# EAGLE design knobtesterB (EAGLE 9.6.2)
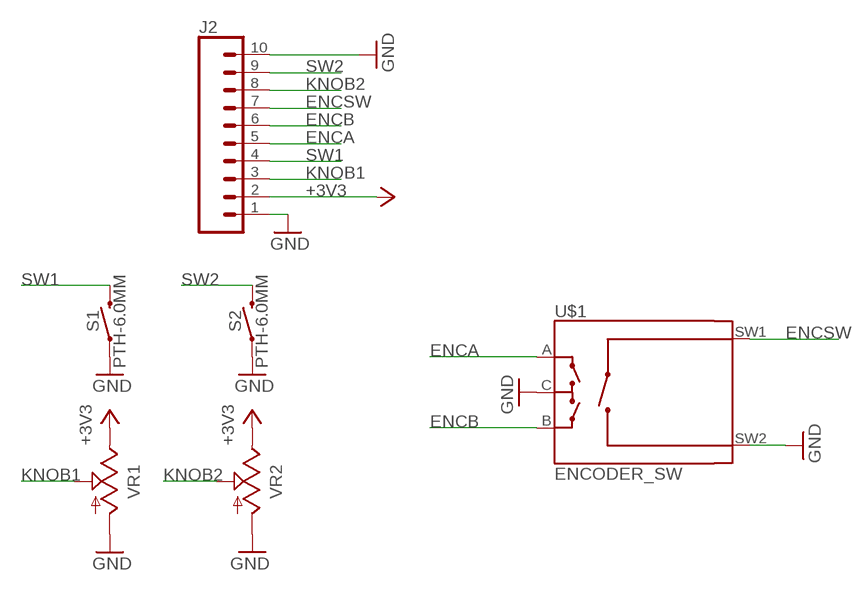
[diagram p0: schematic, sheet 1]

## Parts
J2  CONN_10"  [1X10]
S1  PTH-6.0MM  MOMENTARY-SWITCH-SPST-PTH-6.0MM  [TACTILE_SWITCH_PTH_6.0MM]
S2  PTH-6.0MM  MOMENTARY-SWITCH-SPST-PTH-6.0MM  [TACTILE_SWITCH_PTH_6.0MM]
U$1  ENCODER_SW  [ENCODER_SW]
VR1  9MM_SNAP-IN_POT_  [9MM_SNAP-IN_POT]
VR2  9MM_SNAP-IN_POT_  [9MM_SNAP-IN_POT]

## Nets
+3V3: J2.2 VR1.3(E) VR2.3(E)
ENCA: J2.5 U$1.A
ENCB: J2.6 U$1.B
ENCSW: J2.7 U$1.SW1
GND: J2.1 J2.10 S1.1 S2.1 U$1.C U$1.SW2 VR1.1(A) VR2.1(A)
KNOB1: J2.3 VR1.2(S)
KNOB2: J2.8 VR2.2(S)
SW1: J2.4 S1.3
SW2: J2.9 S2.3

## Library data of the parts
J2 = SparkFun-Connectors:CONN_10: Multi connection point. Often used as Generic Header-pin footprint for 0.1 inch spaced/style header connections On any of the 0.1 inch spaced packages, you can populate with these: Break Away Headers - Straight <https://www.sparkfun.com/products/116> (PRT-00116) Break Away Male Headers - Right Angle <https://www.sparkfun.com/products/553> (PRT-00553) Female Headers <https://www.sparkfun.com/products/115> (PRT-00115) Break Away Headers - Machine Pin <https://www.sparkfun.com/products/117> (PRT-00117) Break Away Female Headers - Swiss Machine Pin <https://www.sparkfun.com/products/743> (PRT-00743) Arduino Stackable Header - 10 Pin <https://www.sparkfun.com/products/11376> (PRT-11376) For SCREWTERMINALS and SPRING TERMINALS visit here: Screw Terimnals on SparkFun.com <https://www.sparkfun.com/search/results?term=Screw+Terminals> (5mm/3.5mm/2.54mm spacing) This device is also useful as a general connection point to wire up your design to another part of your project. Our various solder wires solder well into these plated through hole pads. Hook-Up Wire - Assortment (Stranded, 22 AWG) <https://www.sparkfun.com/products/11375> (PRT-11375) Hook-Up Wire - Assortment (Solid Core, 22 AWG) <https://www.sparkfun.com/products/11367> (PRT-11367) View the entire wire category on our website here <https://www.sparkfun.com/categories/141> Special notes: Molex polarized connector foot print use with SKU : PRT-08231 with associated crimp pins and housings. 1MM SMD Version SKU: PRT-10208 NOTES ON THE VARIANTS LOCK and LOCK_LONGPADS... This footprint was designed to help hold the alignment of a through-hole component (i.e. 6-pin header) while soldering it into place. You may notice that each hole has been shifted either up or down by 0.005 of an inch from it's more standard position (which is a perfectly straight line). This slight alteration caused the pins (the squares in the middle) to touch the edges of the holes. Because they are alternating, it causes a "brace" to hold the component in place. 0.005 has proven to be the perfect amount of "off-center" position when using our standard breakaway headers. Although looks a little odd when you look at the bare footprint, once you have a header in there, the alteration is very hard to notice. Also,if you push a header all the way into place, it is covered up entirely on the bottom side.; PROD_ID: CONN-11563
S1 S2 = SparkFun-Switches:MOMENTARY-SWITCH-SPST: Momentary Switch (Pushbutton) - SPST Normally-open (NO) SPST momentary switches (buttons, pushbuttons). Variants PTH-12MM - 12mm square, through-hole Momentary Pushbutton Switch - 12mm Square <https://www.sparkfun.com/products/9190> (COM-09190) PTH-6.0MM, PTH-6.0MM-KIT - 6.0mm square, through-hole Mini Pushbutton Switch <https://www.sparkfun.com/products/97> (COM-00097) KIT package intended for soldering kit's - only one side of pads' copper is exposed. PTH-RIGHT-ANGLE-KIT - Right-angle, through-hole Right Angle Tactile Button <https://www.sparkfun.com/products/10791> - Used on SparkFun BigTime Watch Kit <https://www.sparkfun.com/products/11734> SMD-12MM - 12mm square, surface-mount Tactile Button - SMD (12mm) <https://www.sparkfun.com/products/12993> (COM-12993) Used on SparkFun PicoBoard <https://www.sparkfun.com/products/11888> SMD-4.5MM - 4.5mm Square Trackball Switch Used on SparkFun Blackberry Trackballer Breakout <https://www.sparkfun.com/products/13169> SMD-4.6MMX2.8MM - 4.60mm x 2.80mm, surface mount Used on SparkFun SAMD21 Mini Breakout <https://www.sparkfun.com/products/13664> SMD-5.2MM, SMD-5.2-REDUNDANT - 5.2mm square, surface-mount Mini Pushbutton Switch - SMD <https://www.sparkfun.com/products/8720> (COM-08720) Used on Arduino Pro Mini <https://www.sparkfun.com/products/11114> REDUNDANT package connects both switch circuits together SMD-6.0X3.5MM - 6.0 x 3.5mm, surface mount Momentary Reset Switch SMD <https://www.sparkfun.com/products/8229> (COM-08229) SMD-6.2MM-TALL - 6.2mm square, surface mount Tactile Button - SMD (6mm) <https://www.sparkfun.com/products/12992> Used on SparkFun Digital Sandbox <https://www.sparkfun.com/products/12651> SMD-RIGHT-ANGLE - Right-angle, surface mount Used on SparkFun Block for Intel® Edison - Arduino <https://www.sparkfun.com/products/13036>; PROD_ID: SWCH-08441; SF_SKU: COM-00097
U$1 = halcyonmod_Switches:ENCODER_SW: Encoder, with Switch
VR1 VR2 = MusicThingModular:9MM_SNAP-IN_POT: 9mm vertical snap-in pot, Alpha / Panasonic style

## Board
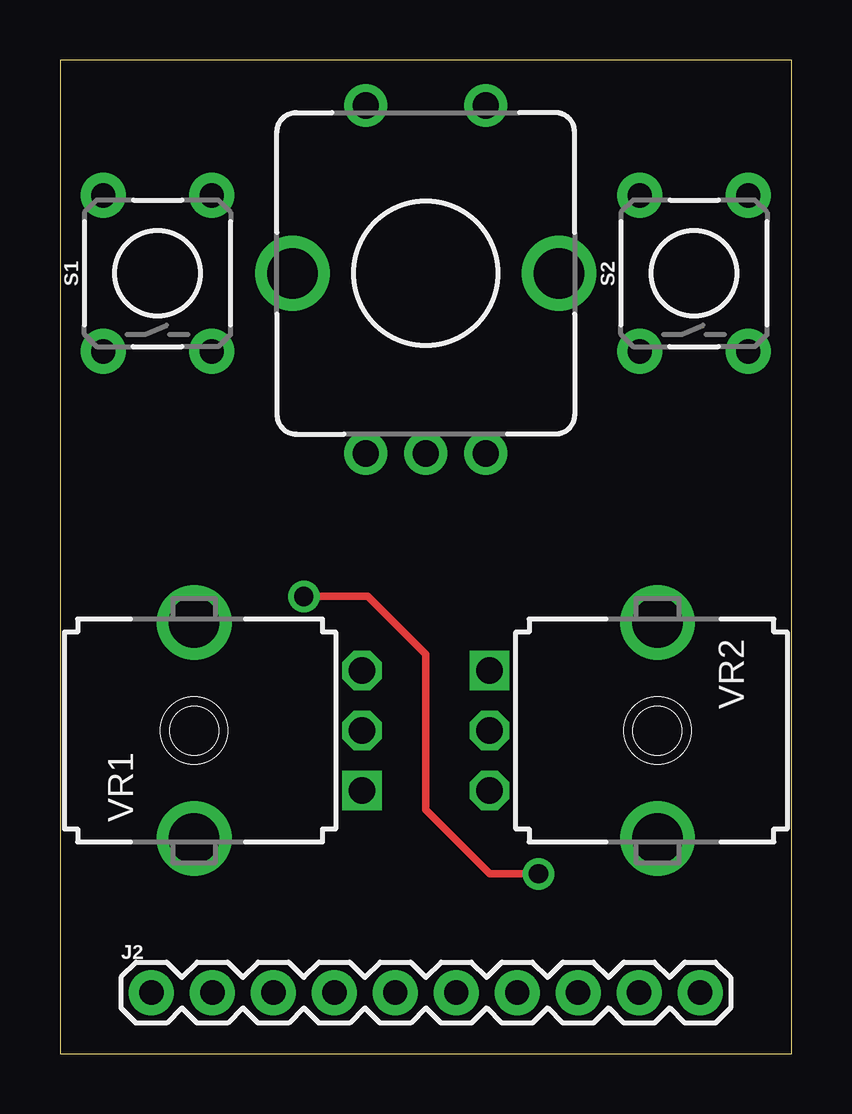
[diagram p1: board, top side]
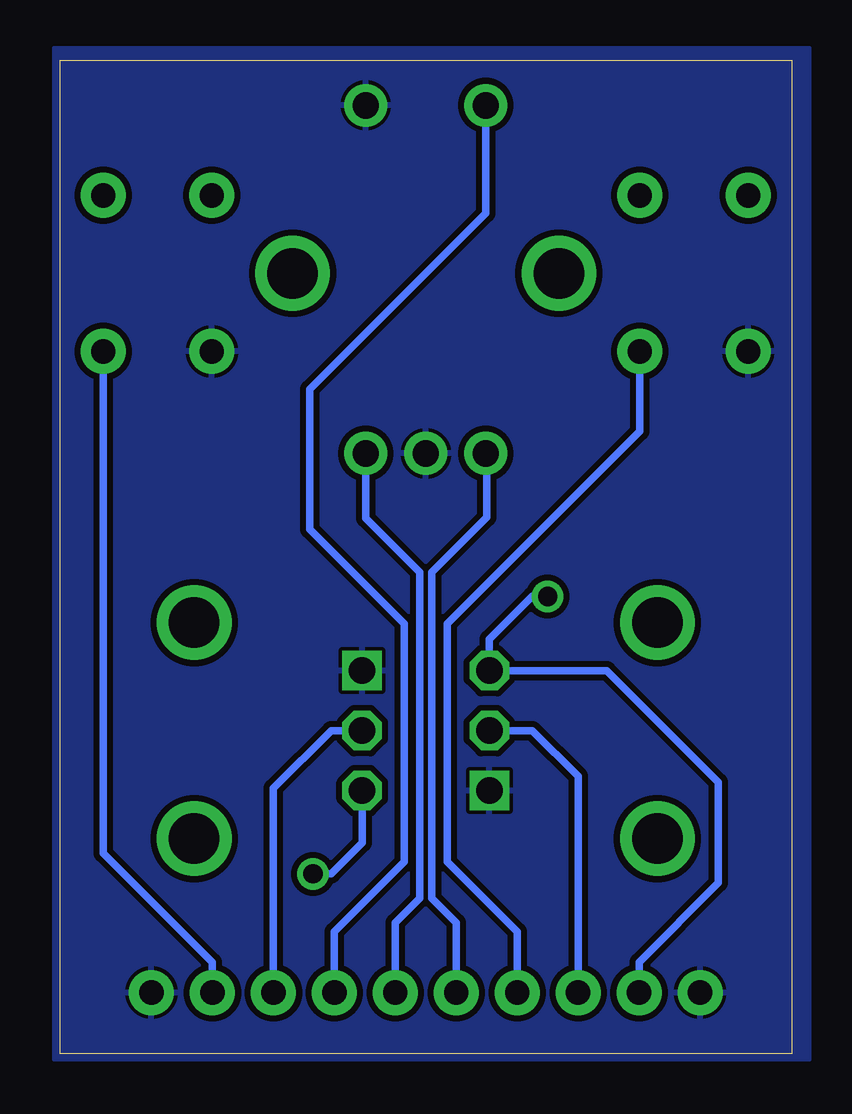
[diagram p2: board, bottom side, seen from below]

Size 30.48 x 41.4 mm. Coordinates in mm from the lower left corner, seen from the top.
Outline: 0,0 30.48,0 30.48,41.4 0,41.4 0,0
Copper layers (1*16): Top 0.035mm / dielectric 1.5mm / Bottom 0.035mm
Design rules "OthermillDRC_30_deg_v2": minimum track width 6mil, minimum drill 0.8mm, track to track 6mil, track to pad 6mil, pad to pad 6mil, via to via 6mil, smd to smd 0mil, copper to edge 0mil, drill to drill 6mil, minimum pad ring 10mil, minimum via ring 10mil, stop-mask expansion 1mil, vias tented up to drill 30mil, thermal gap 6mil

### Footprints (pad centres in the part's own frame; a part is rotated, then mirrored left to right if it is on the bottom)
1X10 = drill 1.016 pad 1.88: 1 0,0; 2 2.54,0; 3 5.08,0; 4 7.62,0; 5 10.16,0; 6 12.7,0; 7 15.24,0; 8 17.78,0; 9 20.32,0; 10 22.86,0
TACTILE_SWITCH_PTH_6.0MM = drill 1.016 pad 1.88: 1 -3.251,2.261; 2 3.251,2.261; 3 -3.251,-2.261; 4 3.251,-2.261
ENCODER_SW = drill 1.1 pad 1.8: A -2.5,-7.5; B 2.5,-7.5; C 0,-7.5 | drill 2.1: M1 -5.55,0; M2 5.55,0 | drill 1.1 pad 1.778: SW1 -2.5,7; SW2 2.5,7
9MM_SNAP-IN_POT = drill 1.1 square: 1 -2.5,-7 | drill 1.1 octagon: 2 0,-7; 3 2.5,-7 | drill 2.1 pad 2.794: CHASSIS1 -4.5,0; CHASSIS2 4.5,0

### Placement (x,y rotation side)
J2  3.81,2.54 0 top
S1  4.06,32.51 90 top
S2  26.42,32.51 90 top
U$1  15.24,32.51 0 top
VR1  5.59,13.46 90 top
VR2  24.89,13.46 270 top

### Tracks (layer width: path | path; a pad name or v marks a point on that pad's centre or on a via)
+3V3  (via drill 0.8)
  Top 0.305: v19.94,7.49 17.91,7.49 15.24,10.16 15.24,16.64 12.83,19.05 v10.16,19.05
  Bottom 0.305: v10.16,19.05 10.79,19.05 12.59,17.26 VR1.3 7.71,15.96 3.05,11.3 3.05,7.11 6.35,3.81 J2.2 | VR2.3 17.89,8.78 19.18,7.49 v19.94,7.49
ENCA
  Bottom 0.305: J2.5 13.97,5.46 14.99,6.48 14.99,20.07 12.7,22.35 12.7,24.97 U$1.A
ENCB
  Bottom 0.305: J2.6 16.51,5.46 15.49,6.48 15.49,20.07 17.74,22.31 U$1.B
ENCSW
  Bottom 0.305: J2.7 19.05,5.08 16.13,8 16.13,17.91 20.07,21.84 20.07,27.69 12.74,35.01 U$1.SW1
GND
  pour Bottom (isolate 0.254): -0.76,41.91 30.73,41.91 30.73,-0.25 -0.76,-0.25
KNOB1
  Bottom 0.305: VR1.2 10.79,13.46 8.89,11.56 J2.3
KNOB2
  Bottom 0.305: J2.8 21.59,11.05 19.18,13.46 VR2.2
SW1
  Bottom 0.305: S1.3 6.33,25.93 14.35,17.91 14.35,8 11.43,5.08 J2.4
SW2
  Bottom 0.305: S2.3 28.68,8.36 24.13,3.81 J2.9